# Altium schematic sheet AMC_CON.SchDoc
size 420 x 297 mm; SheetNumber: 4; SheetTotal: 6; ModifiedBy: -; CheckedDate: -; Title2: Title 2; DivGrp: WUT ISE; Designer: G.Kasprowicz
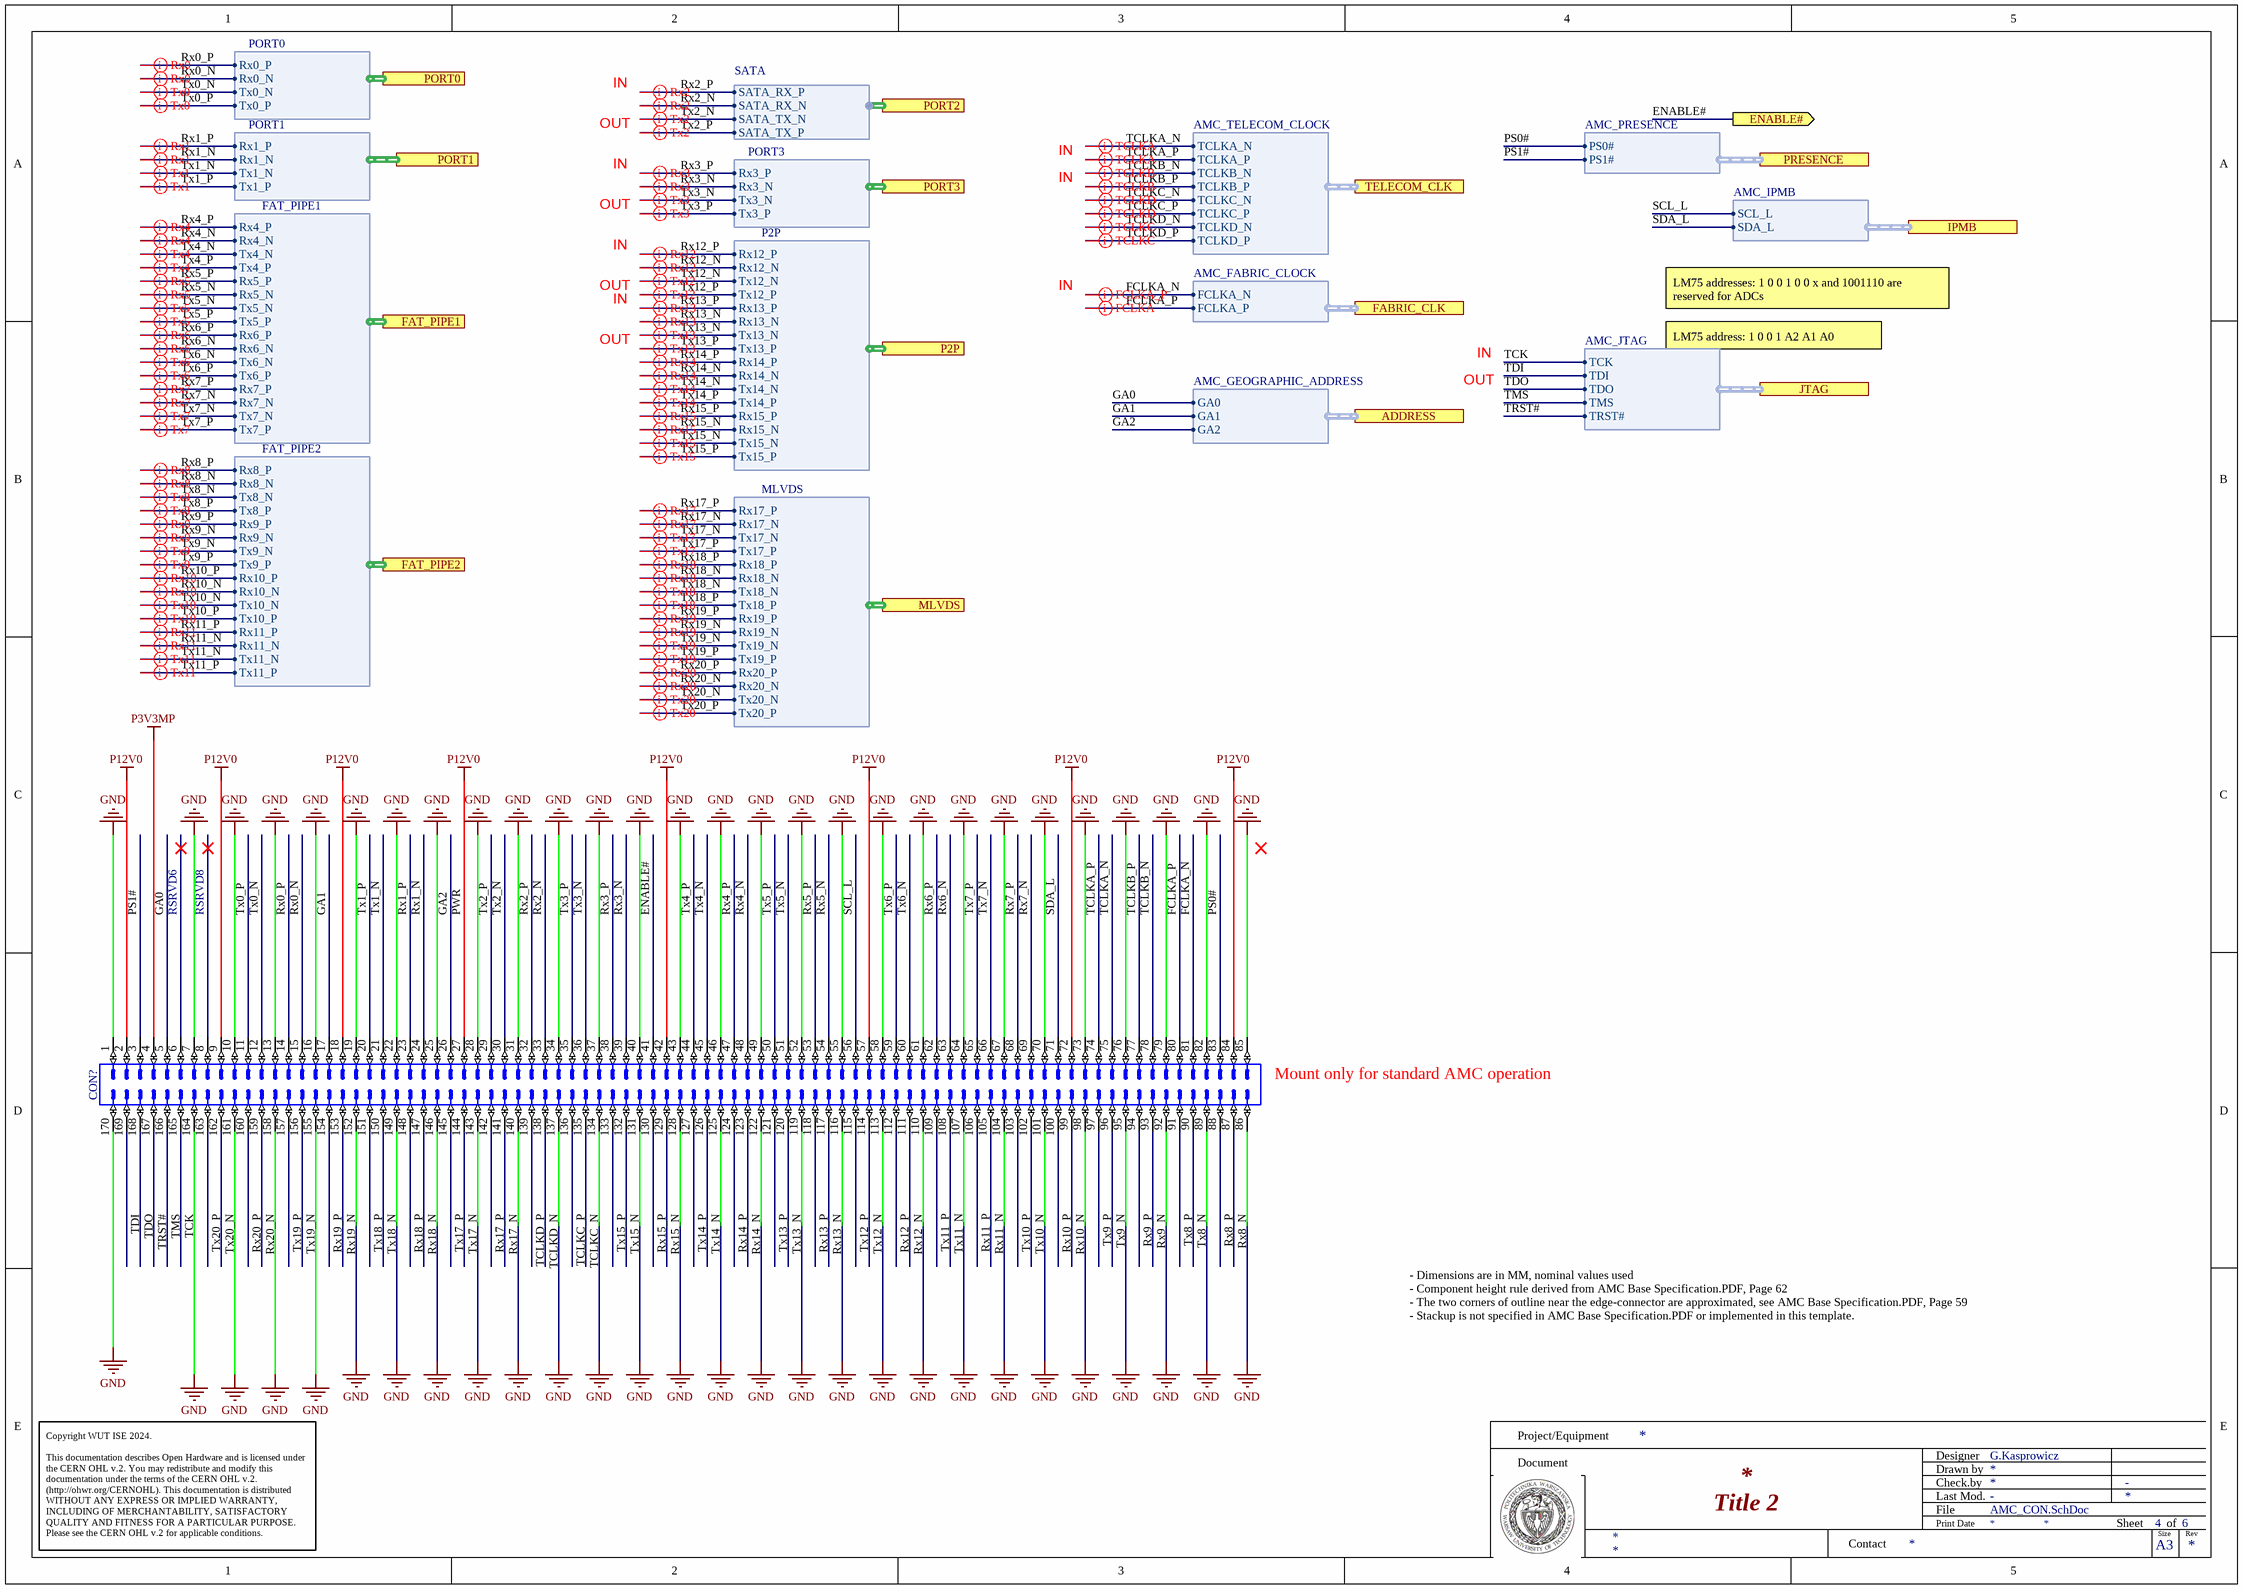
[diagram p0: AMC_CON.SchDoc]

## Parts
CON?  AMC  [HARTING_16 21 170 1303 000]  (value not drawn)

## Ports
ADDRESS (harness AMC_GEOGRAPHIC_ADDRESS), ENABLE# (out), FABRIC_CLK (harness AMC_FABRIC_CLOCK), FAT_PIPE1 (harness FAT_PIPE1), FAT_PIPE2 (harness FAT_PIPE2), IPMB (harness AMC_IPMB), JTAG (harness AMC_JTAG), MLVDS (harness MLVDS), P2P (harness P2P), PORT0 (harness PORT0), PORT1 (harness PORT1), PORT2 (harness SATA), PORT3 (harness PORT3), PRESENCE (harness AMC_PRESENCE), TELECOM_CLK (harness AMC_TELECOM_CLOCK)

## Harnesses
AMC_JTAG: TCK, TDI, TDO, TMS, TRST#
AMC_TELECOM_CLOCK: TCLKA_N, TCLKA_P, TCLKB_N, TCLKB_P, TCLKC_N, TCLKC_P, TCLKD_N, TCLKD_P
AMC_GEOGRAPHIC_ADDRESS: GA0, GA1, GA2
AMC_FABRIC_CLOCK: FCLKA_N, FCLKA_P
AMC_IPMB: SCL_L, SDA_L
AMC_PRESENCE: PS0#, PS1#
PORT0: Rx0_P, Rx0_N, Tx0_N, Tx0_P
PORT1: Rx1_P, Rx1_N, Tx1_N, Tx1_P
FAT_PIPE1: Rx4_P, Rx4_N, Tx4_N, Tx4_P, Rx5_P, Rx5_N, Tx5_N, Tx5_P, Rx6_P, Rx6_N, Tx6_N, Tx6_P, Rx7_P, Rx7_N, Tx7_N, Tx7_P
FAT_PIPE2: Rx8_P, Rx8_N, Tx8_N, Tx8_P, Rx9_P, Rx9_N, Tx9_N, Tx9_P, Rx10_P, Rx10_N, Tx10_N, Tx10_P, Rx11_P, Rx11_N, Tx11_N, Tx11_P
P2P: Rx12_P, Rx12_N, Tx12_N, Tx12_P, Rx13_P, Rx13_N, Tx13_N, Tx13_P, Rx14_P, Rx14_N, Tx14_N, Tx14_P, Rx15_P, Rx15_N, Tx15_N, Tx15_P
MLVDS: Rx17_P, Rx17_N, Tx17_N, Tx17_P, Rx18_P, Rx18_N, Tx18_N, Tx18_P, Rx19_P, Rx19_N, Tx19_N, Tx19_P, Rx20_P, Rx20_N, Tx20_N, Tx20_P
PORT3: Rx3_P, Rx3_N, Tx3_N, Tx3_P
SATA: SATA_TX_N, SATA_TX_P, SATA_RX_N, SATA_RX_P

## Nets
GND: CON?.1 CON?.7 CON?.10 CON?.13 CON?.16 CON?.19 CON?.22 CON?.25 CON?.28 CON?.31 CON?.34 CON?.37 CON?.40 CON?.43 CON?.46 CON?.49 CON?.52 CON?.55 CON?.58 CON?.61 CON?.64 CON?.67 CON?.70 CON?.73 CON?.76 CON?.79 CON?.82 CON?.85 CON?.86 CON?.89 CON?.92 CON?.95 CON?.98 CON?.101 CON?.104 CON?.107 CON?.110 CON?.113 CON?.116 CON?.119 CON?.122 CON?.125 CON?.128 CON?.131 CON?.134 CON?.137 CON?.140 CON?.143 CON?.146 CON?.149 CON?.152 CON?.155 CON?.158 CON?.161 CON?.164 CON?.170
P3V3MP: CON?.4
PWR: CON?.2 CON?.9 CON?.18 CON?.27 CON?.42 CON?.57 CON?.72 CON?.84  [also labelled P12V0]
ENABLE#: CON?.41 ; port ENABLE#
FCLKA_N: CON?.81 ; port FABRIC_CLK.FCLKA_N
FCLKA_P: CON?.80 ; port FABRIC_CLK.FCLKA_P
GA0: CON?.5 ; port ADDRESS.GA0
GA1: CON?.17 ; port ADDRESS.GA1
GA2: CON?.26 ; port ADDRESS.GA2
PS0#: CON?.83 ; port PRESENCE.PS0#
PS1#: CON?.3 ; port PRESENCE.PS1#
Rx0_N: CON?.15 ; port PORT0.Rx0_N
Rx0_P: CON?.14 ; port PORT0.Rx0_P
Rx1_N: CON?.24 ; port PORT1.Rx1_N
Rx1_P: CON?.23 ; port PORT1.Rx1_P
Rx2_N: CON?.33 ; port PORT2.SATA_RX_N
Rx2_P: CON?.32 ; port PORT2.SATA_RX_P
Rx3_N: CON?.39 ; port PORT3.Rx3_N
Rx3_P: CON?.38 ; port PORT3.Rx3_P
Rx4_N: CON?.48 ; port FAT_PIPE1.Rx4_N
Rx4_P: CON?.47 ; port FAT_PIPE1.Rx4_P
Rx5_N: CON?.54 ; port FAT_PIPE1.Rx5_N
Rx5_P: CON?.53 ; port FAT_PIPE1.Rx5_P
Rx6_N: CON?.63 ; port FAT_PIPE1.Rx6_N
Rx6_P: CON?.62 ; port FAT_PIPE1.Rx6_P
Rx7_N: CON?.69 ; port FAT_PIPE1.Rx7_N
Rx7_P: CON?.68 ; port FAT_PIPE1.Rx7_P
Rx8_N: CON?.87 ; port FAT_PIPE2.Rx8_N
Rx8_P: CON?.88 ; port FAT_PIPE2.Rx8_P
Rx9_N: CON?.93 ; port FAT_PIPE2.Rx9_N
Rx9_P: CON?.94 ; port FAT_PIPE2.Rx9_P
Rx10_N: CON?.99 ; port FAT_PIPE2.Rx10_N
Rx10_P: CON?.100 ; port FAT_PIPE2.Rx10_P
Rx11_N: CON?.105 ; port FAT_PIPE2.Rx11_N
Rx11_P: CON?.106 ; port FAT_PIPE2.Rx11_P
Rx12_N: CON?.111 ; port P2P.Rx12_N
Rx12_P: CON?.112 ; port P2P.Rx12_P
Rx13_N: CON?.117 ; port P2P.Rx13_N
Rx13_P: CON?.118 ; port P2P.Rx13_P
Rx14_N: CON?.123 ; port P2P.Rx14_N
Rx14_P: CON?.124 ; port P2P.Rx14_P
Rx15_N: CON?.129 ; port P2P.Rx15_N
Rx15_P: CON?.130 ; port P2P.Rx15_P
Rx17_N: CON?.141 ; port MLVDS.Rx17_N
Rx17_P: CON?.142 ; port MLVDS.Rx17_P
Rx18_N: CON?.147 ; port MLVDS.Rx18_N
Rx18_P: CON?.148 ; port MLVDS.Rx18_P
Rx19_N: CON?.153 ; port MLVDS.Rx19_N
Rx19_P: CON?.154 ; port MLVDS.Rx19_P
Rx20_N: CON?.159 ; port MLVDS.Rx20_N
Rx20_P: CON?.160 ; port MLVDS.Rx20_P
SCL_L: CON?.56 ; port IPMB.SCL_L
SDA_L: CON?.71 ; port IPMB.SDA_L
TCK: CON?.165 ; port JTAG.TCK
TCLKA_N: CON?.75 ; port TELECOM_CLK.TCLKA_N
TCLKA_P: CON?.74 ; port TELECOM_CLK.TCLKA_P
TCLKB_N: CON?.78 ; port TELECOM_CLK.TCLKB_N
TCLKB_P: CON?.77 ; port TELECOM_CLK.TCLKB_P
TCLKC_N: CON?.135 ; port TELECOM_CLK.TCLKC_N
TCLKC_P: CON?.136 ; port TELECOM_CLK.TCLKC_P
TCLKD_N: CON?.138 ; port TELECOM_CLK.TCLKD_N
TCLKD_P: CON?.139 ; port TELECOM_CLK.TCLKD_P
TDI: CON?.169 ; port JTAG.TDI
TDO: CON?.168 ; port JTAG.TDO
TMS: CON?.166 ; port JTAG.TMS
TRST#: CON?.167 ; port JTAG.TRST#
Tx0_N: CON?.12 ; port PORT0.Tx0_N
Tx0_P: CON?.11 ; port PORT0.Tx0_P
Tx1_N: CON?.21 ; port PORT1.Tx1_N
Tx1_P: CON?.20 ; port PORT1.Tx1_P
Tx2_N: CON?.30 ; port PORT2.SATA_TX_N
Tx2_P: CON?.29 ; port PORT2.SATA_TX_P
Tx3_N: CON?.36 ; port PORT3.Tx3_N
Tx3_P: CON?.35 ; port PORT3.Tx3_P
Tx4_N: CON?.45 ; port FAT_PIPE1.Tx4_N
Tx4_P: CON?.44 ; port FAT_PIPE1.Tx4_P
Tx5_N: CON?.51 ; port FAT_PIPE1.Tx5_N
Tx5_P: CON?.50 ; port FAT_PIPE1.Tx5_P
Tx6_N: CON?.60 ; port FAT_PIPE1.Tx6_N
Tx6_P: CON?.59 ; port FAT_PIPE1.Tx6_P
Tx7_N: CON?.66 ; port FAT_PIPE1.Tx7_N
Tx7_P: CON?.65 ; port FAT_PIPE1.Tx7_P
Tx8_N: CON?.90 ; port FAT_PIPE2.Tx8_N
Tx8_P: CON?.91 ; port FAT_PIPE2.Tx8_P
Tx9_N: CON?.96 ; port FAT_PIPE2.Tx9_N
Tx9_P: CON?.97 ; port FAT_PIPE2.Tx9_P
Tx10_N: CON?.102 ; port FAT_PIPE2.Tx10_N
Tx10_P: CON?.103 ; port FAT_PIPE2.Tx10_P
Tx11_N: CON?.108 ; port FAT_PIPE2.Tx11_N
Tx11_P: CON?.109 ; port FAT_PIPE2.Tx11_P
Tx12_N: CON?.114 ; port P2P.Tx12_N
Tx12_P: CON?.115 ; port P2P.Tx12_P
Tx13_N: CON?.120 ; port P2P.Tx13_N
Tx13_P: CON?.121 ; port P2P.Tx13_P
Tx14_N: CON?.126 ; port P2P.Tx14_N
Tx14_P: CON?.127 ; port P2P.Tx14_P
Tx15_N: CON?.132 ; port P2P.Tx15_N
Tx15_P: CON?.133 ; port P2P.Tx15_P
Tx17_N: CON?.144 ; port MLVDS.Tx17_N
Tx17_P: CON?.145 ; port MLVDS.Tx17_P
Tx18_N: CON?.150 ; port MLVDS.Tx18_N
Tx18_P: CON?.151 ; port MLVDS.Tx18_P
Tx19_N: CON?.156 ; port MLVDS.Tx19_N
Tx19_P: CON?.157 ; port MLVDS.Tx19_P
Tx20_N: CON?.162 ; port MLVDS.Tx20_N
Tx20_P: CON?.163 ; port MLVDS.Tx20_P

Not connected (* = marked no-connect by the designer): CON? 6* 8*

## Layout directives
differential pair: FCLKA_N, FCLKA_P, Rx0_N, Rx0_P, Rx1_N, Rx1_P, Rx2_N, Rx2_P, Rx3_N, Rx3_P, Rx4_N, Rx4_P, Rx5_N, Rx5_P, Rx6_N, Rx6_P, Rx7_N, Rx7_P, Rx8_N, Rx8_P, Rx9_N, Rx9_P, Rx10_N, Rx10_P, Rx11_N, Rx11_P, Rx12_N, Rx12_P, Rx13_N, Rx13_P, Rx14_N, Rx14_P, Rx15_N, Rx15_P, Rx17_N, Rx17_P, Rx18_N, Rx18_P, Rx19_N, Rx19_P, Rx20_N, Rx20_P, TCLKA_N, TCLKA_P, TCLKB_N, TCLKB_P, TCLKC_N, TCLKC_P, TCLKD_N, TCLKD_P, Tx0_N, Tx0_P, Tx1_N, Tx1_P, Tx2_N, Tx2_P, Tx3_N, Tx3_P, Tx4_N, Tx4_P, Tx5_N, Tx5_P, Tx6_N, Tx6_P, Tx7_N, Tx7_P, Tx8_N, Tx8_P, Tx9_N, Tx9_P, Tx10_N, Tx10_P, Tx11_N, Tx11_P, Tx12_N, Tx12_P, Tx13_N, Tx13_P, Tx14_N, Tx14_P, Tx15_N, Tx15_P, Tx17_N, Tx17_P, Tx18_N, Tx18_P, Tx19_N, Tx19_P, Tx20_N, Tx20_P

## Notes on the sheet
- OUT
- IN
- LM75 addresses: 1 0 0 1 0 0 x and 1001110 are reserved for ADCs
- LM75 address: 1 0 0 1 A2 A1 A0
- RSRVD6
- RSRVD8
- (near CON?) Mount only for standard AMC operation
- - Dimensions are in MM, nominal values used
  - Component height rule derived from AMC Base Specification.PDF, Page 62
  - The two corners of outline near the edge-connector are approximated, see AMC Base Specification.PDF, Page 59
  - Stackup is not specified in AMC Base Specification.PDF or implemented in this template.
- Project/Equipment
- Document
- Designer
- Drawn by
- Check.by
- Copyright WUT ISE 2024.
  This documentation describes Open Hardware and is licensed under the CERN OHL v.2. You may redistribute and modify this documentation under the terms of the CERN OHL v.2. (http://ohwr.org/CERNOHL). This documentation is distributed WITHOUT ANY EXPRESS OR IMPLIED WARRANTY, INCLUDING OF MERCHANTABILITY, SATISFACTORY QUALITY AND FITNESS FOR A PARTICULAR PURPOSE. Please see the CERN OHL v.2 for applicable conditions.
- Contact
- File
- Last Mod.
- Print Date
- Sheet
- Size
- A3
- of
- Rev

## Library data of the parts
CON? = HARTING_16 21 170 1303 000: 170 Poles, Extended Side, Advanced Mezzanine Card Plug Connector, AMC; Part Description: 170 Poles, Extended Side, Advanced Mezzanine Card (AMC) Plug Connector, Serie ATCA / mTCA; Part Number: HARTING_16 21 170 1303 000; Component Kind: Standard; Component Type: Standard; Pin Count: 170; Family: AMC; Mounted: Yes; Socket: No; SMD: No; Status: None; Manufacturer: HARTING; Manufacturer Part Number: 16 21 170 1303 000; ComponentHeight: 2.44mm; HelpURL: \\cern.ch\dfs\Applications\Altium\Datasheets\HARTING_16 21 170 1303 000.pdf; Author: CERN DEM JLC; CreateDate: 2012-03-06; LatestRevisionDate: 2012-03-06; Table: HARTING